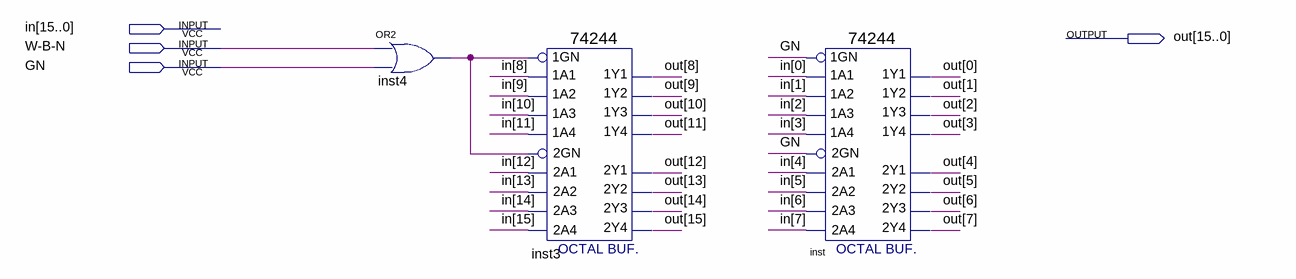
[diagram p0: schematic sheet]
// Quartus schematic Trigate_16bit_eq8bitX2.bdf as structural Verilog: 3 symbols, 4 pins
module Trigate_16bit_eq8bitX2 (
  input  [15:0] in,
  input  \W-B-N ,
  input  GN,
  output [15:0] out
);

  wire inst4_out;

  or inst4 (inst4_out, \W-B-N , GN);
  \74244  inst3 (
    .\1A2 (in[9]), .\1A4 (in[11]), .\1A1 (in[8]), .\1A3 (in[10]), .\1GN (inst4_out), .\2A3 (in[14]),
    .\2GN (inst4_out), .\2A1 (in[12]), .\2A4 (in[15]), .\2A2 (in[13]), .\1Y2 (out[9]), .\1Y4 (out[11]),
    .\2Y1 (out[12]), .\1Y1 (out[8]), .\2Y3 (out[14]), .\2Y4 (out[15]), .\1Y3 (out[10]), .\2Y2 (out[13]));
  \74244  inst (
    .\1A2 (in[1]), .\1A4 (in[3]), .\1A1 (in[0]), .\1A3 (in[2]), .\1GN (GN), .\2A3 (in[6]), .\2GN (GN),
    .\2A1 (in[4]), .\2A4 (in[7]), .\2A2 (in[5]), .\1Y2 (out[1]), .\1Y4 (out[3]), .\2Y1 (out[4]),
    .\1Y1 (out[0]), .\2Y3 (out[6]), .\2Y4 (out[7]), .\1Y3 (out[2]), .\2Y2 (out[5]));
endmodule
